# Altium project Quick start  Help for beginners.PrjPcb
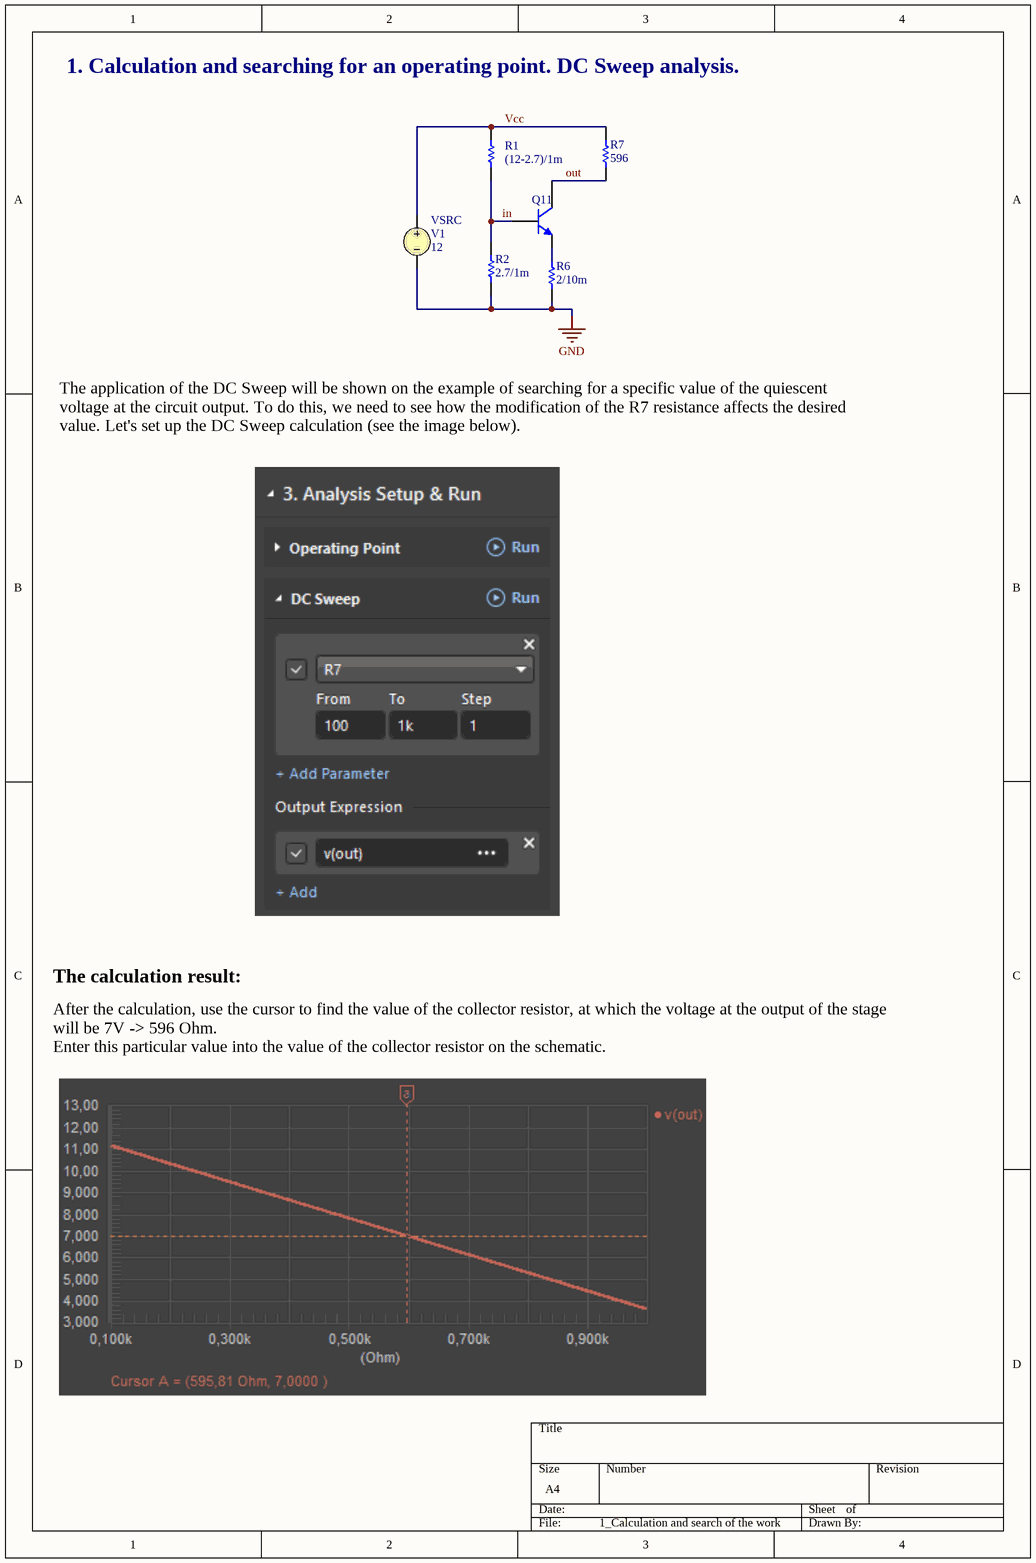
[diagram p0: 1_Calculation and search of the working point.SchDoc]
7 sheets, 56 parts. Net scope: global (net labels, ports and power ports of the same name join across sheets).
Sheets:
  1_Calculation and search of the working point.SchDoc
  2_Thermal stability.SchDoc
  3_Reinforcing properties  Frequency characteristics.SchDoc
  4_A real transistor.SchDoc
  5_Changing the gain.SchDoc
  6_Oscillator.SchDoc
  7_Sensitivity.SchDoc

## Sheet 1_Calculation and search of the working point.SchDoc
size A4 portrait; SheetNumber: 1; SheetTotal: 1; SPICEModelCacheCSPBSJPQ: <root> / <DocumentId>CSPBSJPQ</DocumentId> / </root>

### Parts
Q11  Bipolar  NPN 3 Pins  Transistor  Modified Version of the Gummel-Poon Model  (value not drawn)
R1  value (12-2.7)/1m  (hidden comment: Resistor)
R2  value 2.7/1m  (hidden comment: Resistor)
R6  value 2/10m  (hidden comment: Resistor)
R7  value 596  (hidden comment: Resistor)
V1  VSRC  value 12

### Nets
GND: R2.2 R6.1 V1.2
in: Q11.2(B) R1.1 R2.1
out: Q11.1(C) R7.1
Vcc: R1.2 R7.2 V1.1
NetQ11_3: Q11.3(E) R6.2

### Notes on the sheet
- 1. Calculation and searching for an operating point. DC Sweep analysis.
- The application of the DC Sweep will be shown on the example of searching for a specific value of the quiescent voltage at the circuit output. To do this, we need to see how the modification of the R7 resistance affects the desired value. Let's set up the DC Sweep calculation (see the image below).
- The calculation result:
- After the calculation, use the cursor to find the value of the collector resistor, at which the voltage at the output of the stage will be 7V -> 596 Ohm.
  Enter this particular value into the value of the collector resistor on the schematic.

### Library data of the parts
Q11 = BJT NPN_MGP: BF: 100; AF: 0; BR: 1; EG: 1.11; FC: 0.5; IS: 1e-16; MJC: 0.33; NC: 2; NE: 1.5; TNOM: 27; VBC_MAX: 1e99; VJC: 0.75; XTI: 3; SimulationGenericComponent: True; CJC: 0; CJE: 0; CJS: 0; CTC: 0; CTE: 0; CTS: 0; IKF: 0; IKR: 0; IRB: 0; ISC: 0; ISE: 0; ISS: 0; ITF: 0; KF: 0; MJE: 0.33; MJS: 0; NF: 1; NKF: 0.5; NR: 1; NS: 1; PTF: 0; RB: 0; RBM: 0; RC: 0; RE: 0; SUBS: 1; TBF1: 0; TBF2: 0; TBR1: 0; TBR2: 0; TF: 0; TIKF1: 0; TIKF2: 0; TIKR1: 0; TIKR2: 0; TIRB1: 0; TIRB2: 0; TIS1: 0; TIS2: 0; TISC1: 0; TISC2: 0; TISE1: 0; TISE2: 0; TITF1: 0; TITF2: 0; TLEV: 0; TLEVC: 0; TMJC1: 0; TMJC2: 0; TMJE1: 0; TMJE2: 0; TMJS1: 0; TMJS2: 0; TNC1: 0; TNC2: 0; TNE1: 0; TNE2: 0; TNF1: 0; TNF2: 0; TNR1: 0; TNR2: 0; TNS1: 0; TNS2: 0; TR: 0; TRB1: 0; TRB2: 0; TRC1: 0; TRC2: 0; TRE1: 0; TRE2: 0; TRM1: 0; TRM2: 0; TTF1: 0; TTF2: 0; TTR1: 0; TTR2: 0; TVAF1: 0; TVAF2: 0; TVAR1: 0; TVAR2: 0; TVJC: 0; TVJE: 0; TVJS: 0; VAF: 0; VAR: 0; VBE_MAX: 1e99; VCE_MAX: 1e99; VJE: 0.75; VJS: 0.75; VTF: 0; XCJC: 1; XTB: 0; XTF: 0
V1 = VSRC: Voltage Source; Note: PCB Footprint - Not required; AC Magnitude: 0; Published: 30-July-2020; LatestRevisionDate: 30-July-2020; LatestRevisionNote: Re-released for DXP Platform.; PackageReference: Not Applicable; Publisher: Altium Limited

## Sheet 2_Thermal stability.SchDoc
size A4; SheetNumber: 1; SheetTotal: 1; SPICEModelCacheCSPBSJPQ: <root> / <DocumentId>CSPBSJPQ</DocumentId> / </root>
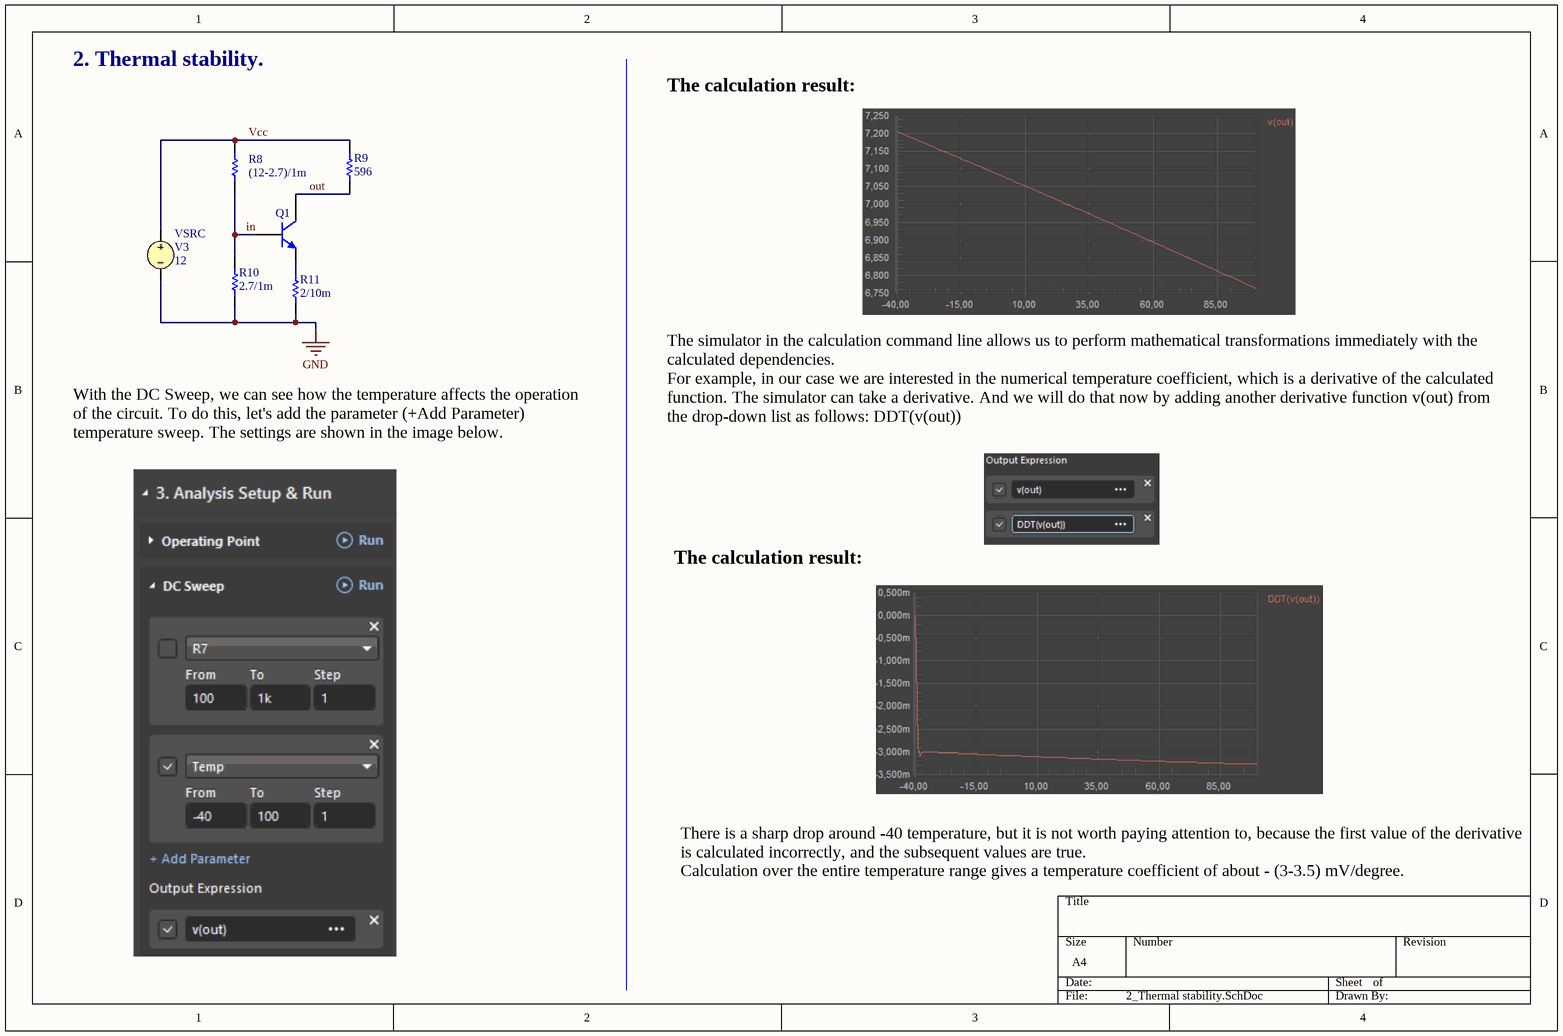
[diagram p1: 2_Thermal stability.SchDoc]

### Parts
Q1  Bipolar  NPN 3 Pins  Transistor  Modified Version of the Gummel-Poon Model  (value not drawn)
R8  value (12-2.7)/1m  (hidden comment: Resistor)
R9  value 596  (hidden comment: Resistor)
R10  value 2.7/1m  (hidden comment: Resistor)
R11  value 2/10m  (hidden comment: Resistor)
V3  VSRC  value 12

### Nets
GND: R10.2 R11.1 V3.2
in: Q1.2(B) R8.1 R10.1
out: Q1.1(C) R9.1
Vcc: R8.2 R9.2 V3.1
NetQ1_3: Q1.3(E) R11.2

### Notes on the sheet
- 2. Thermal stability.
- The calculation result:
- The simulator in the calculation command line allows us to perform mathematical transformations immediately with the calculated dependencies.
  For example, in our case we are interested in the numerical temperature coefficient, which is a derivative of the calculated function. The simulator can take a derivative. And we will do that now by adding another derivative function v(out) from the drop-down list as follows: DDT(v(out))
- With the DC Sweep, we can see how the temperature affects the operation of the circuit. To do this, let's add the parameter (+Add Parameter) temperature sweep. The settings are shown in the image below.
- There is a sharp drop around -40 temperature, but it is not worth paying attention to, because the first value of the derivative is calculated incorrectly, and the subsequent values are true.
  Calculation over the entire temperature range gives a temperature coefficient of about - (3-3.5) mV/degree.

### Library data of the parts
Q1 = BJT NPN_MGP: as Q11 on sheet 1_Calculation and search of the working point; CJC: 0; CJE: 0; CJS: 0; CTC: 0; CTE: 0; CTS: 0; IKF: 0; IKR: 0; IRB: 0; ISC: 0; ISE: 0; ISS: 0; ITF: 0; KF: 0; MJE: 0.33; MJS: 0; NF: 1; NKF: 0.5; NR: 1; NS: 1; PTF: 0; RB: 0; RBM: 0; RC: 0; RE: 0; SUBS: 1; TBF1: 0; TBF2: 0; TBR1: 0; TBR2: 0; TF: 0; TIKF1: 0; TIKF2: 0; TIKR1: 0; TIKR2: 0; TIRB1: 0; TIRB2: 0; TIS1: 0; TIS2: 0; TISC1: 0; TISC2: 0; TISE1: 0; TISE2: 0; TITF1: 0; TITF2: 0; TLEV: 0; TLEVC: 0; TMJC1: 0; TMJC2: 0; TMJE1: 0; TMJE2: 0; TMJS1: 0; TMJS2: 0; TNC1: 0; TNC2: 0; TNE1: 0; TNE2: 0; TNF1: 0; TNF2: 0; TNR1: 0; TNR2: 0; TNS1: 0; TNS2: 0; TR: 0; TRB1: 0; TRB2: 0; TRC1: 0; TRC2: 0; TRE1: 0; TRE2: 0; TRM1: 0; TRM2: 0; TTF1: 0; TTF2: 0; TTR1: 0; TTR2: 0; TVAF1: 0; TVAF2: 0; TVAR1: 0; TVAR2: 0; TVJC: 0; TVJE: 0; TVJS: 0; VAF: 0; VAR: 0; VBE_MAX: 1e99; VCE_MAX: 1e99; VJE: 0.75; VJS: 0.75; VTF: 0; XCJC: 1; XTB: 0; XTF: 0
V3 = VSRC: as V1 on sheet 1_Calculation and search of the working point; Published: 30-July-2020; LatestRevisionDate: 30-July-2020; LatestRevisionNote: Re-released for DXP Platform.; PackageReference: Not Applicable; Publisher: Altium Limited

## Sheet 3_Reinforcing properties  Frequency characteristics.SchDoc
size A4; SheetNumber: 1; SheetTotal: 1; SPICEModelCacheCSPBSJPQ: <root> / <DocumentId>CSPBSJPQ</DocumentId> / </root>
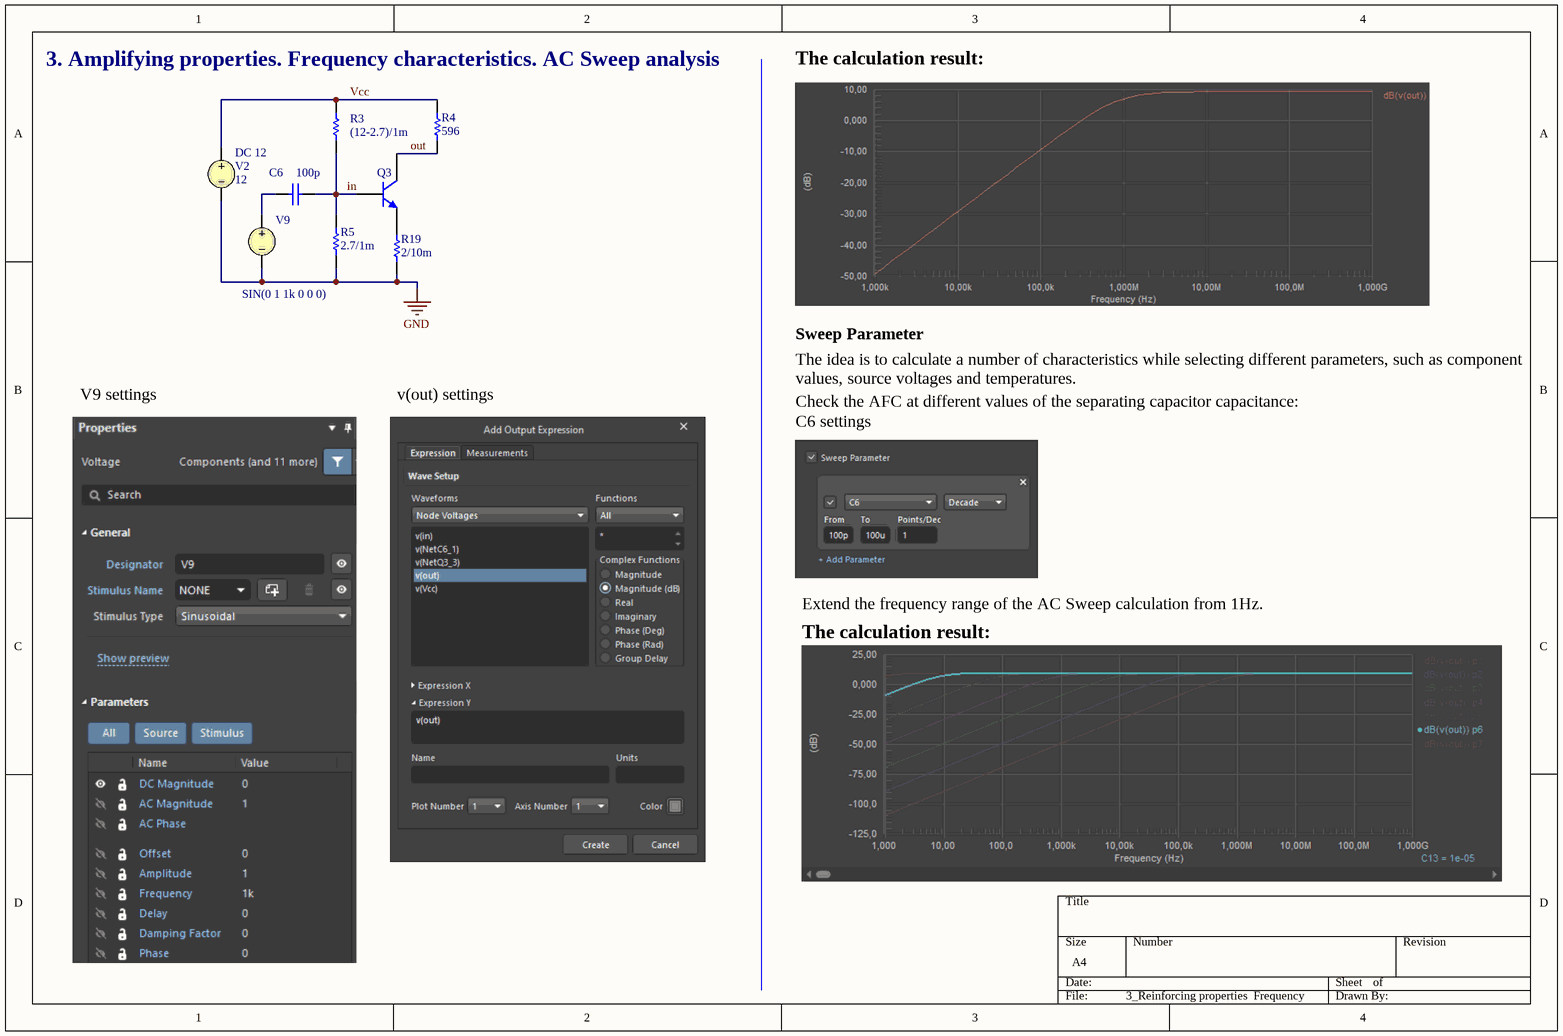
[diagram p2: 3_Reinforcing properties  Frequency characteristics.SchDoc]

### Parts
C6  value 100p  (hidden comment: Capacitor)
Q3  Bipolar  NPN 3 Pins  Transistor  Modified Version of the Gummel-Poon Model  (value not drawn)
R3  value (12-2.7)/1m  (hidden comment: Resistor)
R4  value 596  (hidden comment: Resistor)
R5  value 2.7/1m  (hidden comment: Resistor)
R19  value 2/10m  (hidden comment: Resistor)
V2  DC 12  value 12
V9  SIN(0 1 1k 0 0 0)

### Nets
GND: R5.2 R19.1 V2.2 V9.2
in: C6.2 Q3.2(B) R3.1 R5.1
out: Q3.1(C) R4.1
Vcc: R3.2 R4.2 V2.1
NetC6_1: C6.1 V9.1
NetQ3_3: Q3.3(E) R19.2

### Notes on the sheet
- 3. Amplifying properties. Frequency characteristics. AC Sweep analysis
- The calculation result:
- The idea is to calculate a number of characteristics while selecting different parameters, such as component values, source voltages and temperatures.
- Sweep Parameter
- V9 settings
- v(out) settings
- Check the AFC at different values of the separating capacitor capacitance:
- C6 settings
- Extend the frequency range of the AC Sweep calculation from 1Hz.

### Library data of the parts
C6 = Capacitor: SimulationGenericComponent: True
Q3 = BJT NPN_MGP: as Q11 on sheet 1_Calculation and search of the working point; CJC: 0; CJE: 0; CJS: 0; CTC: 0; CTE: 0; CTS: 0; IKF: 0; IKR: 0; IRB: 0; ISC: 0; ISE: 0; ISS: 0; ITF: 0; KF: 0; MJE: 0.33; MJS: 0; NF: 1; NKF: 0.5; NR: 1; NS: 1; PTF: 0; RB: 0; RBM: 0; RC: 0; RE: 0; SUBS: 1; TBF1: 0; TBF2: 0; TBR1: 0; TBR2: 0; TF: 0; TIKF1: 0; TIKF2: 0; TIKR1: 0; TIKR2: 0; TIRB1: 0; TIRB2: 0; TIS1: 0; TIS2: 0; TISC1: 0; TISC2: 0; TISE1: 0; TISE2: 0; TITF1: 0; TITF2: 0; TLEV: 0; TLEVC: 0; TMJC1: 0; TMJC2: 0; TMJE1: 0; TMJE2: 0; TMJS1: 0; TMJS2: 0; TNC1: 0; TNC2: 0; TNE1: 0; TNE2: 0; TNF1: 0; TNF2: 0; TNR1: 0; TNR2: 0; TNS1: 0; TNS2: 0; TR: 0; TRB1: 0; TRB2: 0; TRC1: 0; TRC2: 0; TRE1: 0; TRE2: 0; TRM1: 0; TRM2: 0; TTF1: 0; TTF2: 0; TTR1: 0; TTR2: 0; TVAF1: 0; TVAF2: 0; TVAR1: 0; TVAR2: 0; TVJC: 0; TVJE: 0; TVJS: 0; VAF: 0; VAR: 0; VBE_MAX: 1e99; VCE_MAX: 1e99; VJE: 0.75; VJS: 0.75; VTF: 0; XCJC: 1; XTB: 0; XTF: 0
V2 = VSRC: as V1 on sheet 1_Calculation and search of the working point; Published: 30-July-2020; LatestRevisionDate: 30-July-2020; LatestRevisionNote: Re-released for DXP Platform.; PackageReference: Not Applicable; Publisher: Altium Limited
V9 = VSRC: Voltage Source; Note: PCB Footprint - Not required; DC Magnitude: 0; AC Magnitude: 1; Published: 30-July-2020; LatestRevisionDate: 30-July-2020; LatestRevisionNote: Re-released for DXP Platform.; PackageReference: Not Applicable; Publisher: Altium Limited; Offset: 0; Amplitude: 1; Frequency: 1k; Delay: 0; Damping Factor: 0; Phase: 0

## Sheet 4_A real transistor.SchDoc
size A4; SheetNumber: 1; SheetTotal: 1; SPICEModelCacheCSPBSJPQ: <root> / <DocumentId>CSPBSJPQ</DocumentId> / <CacheFrame Number="0"> / <Model Name="bc846" Kind="MDL"> / <Text>.MODEL BC846 NPN(  BF=324.4 BR=8.29 CJC=3.347E-12 CJE=1.244E-11 FC=0.979 IKF=0.109 IKR=0.09 IRB=5E-06 IS=1.822E-14 ISC=9.982E-12 ISE=2.894E-16 ITF=0.3131 MJC=0.391 MJE=0.3656 MJS=0.333 NC=1.763 NE=1.4 NF=0.9932 NK=500M NR=0.9931 RB=10 RBM=5 RC=0.7014 RE=0.649 TF=4.908E-10 TR=9E-08 VAF=82 VAR=17.9 VJC=0.5463 VJE=0.7579 VTF=2.927 XCJC=0.6193 XTF=9.51 )</Text> / </Model> / </CacheFrame> / </root>
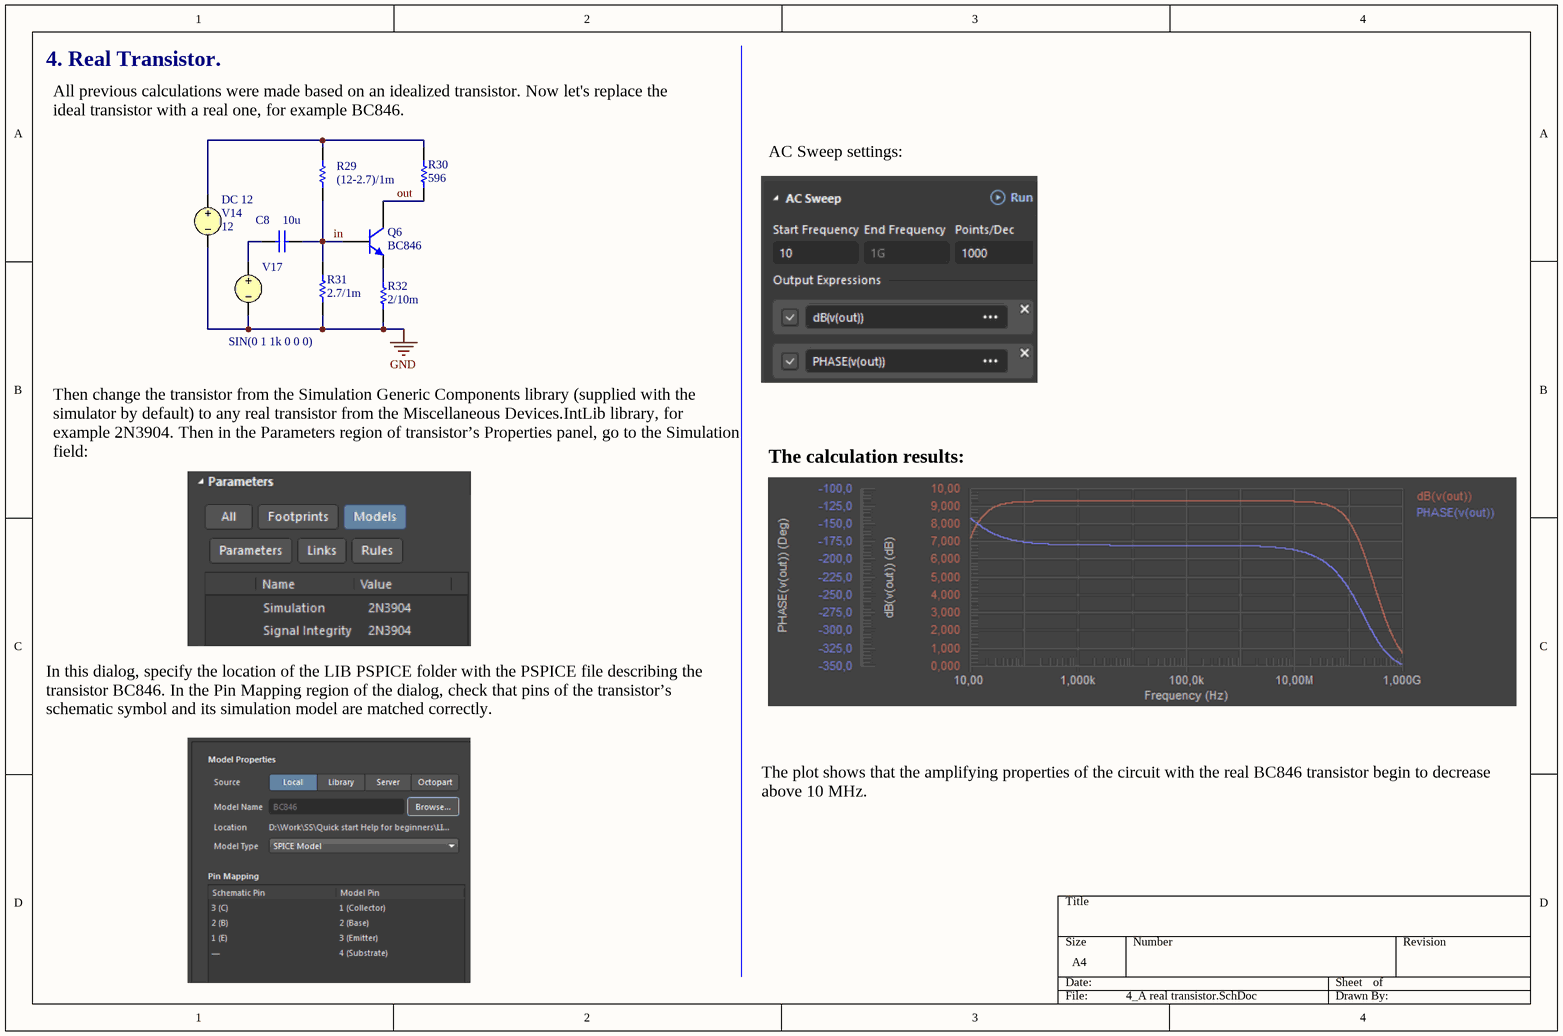
[diagram p3: 4_A real transistor.SchDoc]

### Parts
C8  value 10u  (hidden comment: Capacitor)
Q6  BC846  [TO-92A]
R29  value (12-2.7)/1m  (hidden comment: Resistor)
R30  value 596  (hidden comment: Resistor)
R31  value 2.7/1m  (hidden comment: Resistor)
R32  value 2/10m  (hidden comment: Resistor)
V14  DC 12  value 12
V17  SIN(0 1 1k 0 0 0)

### Nets
GND: R31.2 R32.1 V14.2 V17.2
in: C8.2 Q6.2(B) R29.1 R31.1
out: Q6.3(C) R30.1
Vcc: R29.2 R30.2 V14.1
NetC8_1: C8.1 V17.1
NetQ6_1: Q6.1(E) R32.2

### Notes on the sheet
- 4. Real Transistor.
- All previous calculations were made based on an idealized transistor. Now let's replace the ideal transistor with a real one, for example BC846.
- AC Sweep settings:
- Then change the transistor from the Simulation Generic Components library (supplied with the simulator by default) to any real transistor from the Miscellaneous Devices.IntLib library, for example 2N3904. Then in the Parameters region of transistor’s Properties panel, go to the Simulation field:
- The calculation results:
- In this dialog, specify the location of the LIB PSPICE folder with the PSPICE file describing the transistor BC846. In the Pin Mapping region of the dialog, check that pins of the transistor’s schematic symbol and its simulation model are matched correctly.
- The plot shows that the amplifying properties of the circuit with the real BC846 transistor begin to decrease above 10 MHz.

### Library data of the parts
C8 = Capacitor: SimulationGenericComponent: True
Q6 = 2N3904: NPN General Purpose Amplifier; Published: 8-Jun-2000; LatestRevisionDate: 15-Jan-2003; LatestRevisionNote: PCB Footprint 'BCY-W3/D4.7' replaced; DatasheetVersion: 1997; PackageVersion: Sep-1998; PackageReference: TO-92A; Publisher: Altium Limited; PackageDescription: TO, Flat Index; 3 In-Line, Axial Leads; Body Dia. 4.5mm; Leads 0.51 x 0.48 mm (max); ComponentLink1Description: Manufacturer Link; ComponentLink1URL: http://www.fairchildsemi.com/; ComponentLink2Description: Datasheet; ComponentLink2URL: http://www.fairchildsemi.com/ds/2N%2F2N3904.pdf
V14 = VSRC: as V1 on sheet 1_Calculation and search of the working point; Published: 30-July-2020; LatestRevisionDate: 30-July-2020; LatestRevisionNote: Re-released for DXP Platform.; PackageReference: Not Applicable; Publisher: Altium Limited
V17 = VSRC: as V9 on sheet 3_Reinforcing properties  Frequency characteristics; Published: 30-July-2020; LatestRevisionDate: 30-July-2020; LatestRevisionNote: Re-released for DXP Platform.; PackageReference: Not Applicable; Publisher: Altium Limited; Offset: 0; Amplitude: 1; Frequency: 1k; Delay: 0; Damping Factor: 0; Phase: 0

## Sheet 5_Changing the gain.SchDoc
size A4; SheetNumber: 1; SheetTotal: 1; SPICEModelCacheCSPBSJPQ: <root> / <DocumentId>CSPBSJPQ</DocumentId> / <CacheFrame Number="0"> / <Model Name="bc846" Kind="MDL"> / <Text>.MODEL BC846 NPN(  BF=324.4 BR=8.29 CJC=3.347E-12 CJE=1.244E-11 FC=0.979 IKF=0.109 IKR=0.09 IRB=5E-06 IS=1.822E-14 ISC=9.982E-12 ISE=2.894E-16 ITF=0.3131 MJC=0.391 MJE=0.3656 MJS=0.333 NC=1.763 NE=1.4 NF=0.9932 NK=500M NR=0.9931 RB=10 RBM=5 RC=0.7014 RE=0.649 TF=4.908E-10 TR=9E-08 VAF=82 VAR=17.9 VJC=0.5463 VJE=0.7579 VTF=2.927 XCJC=0.6193 XTF=9.51 )</Text> / </Model> / </CacheFrame> / </root>
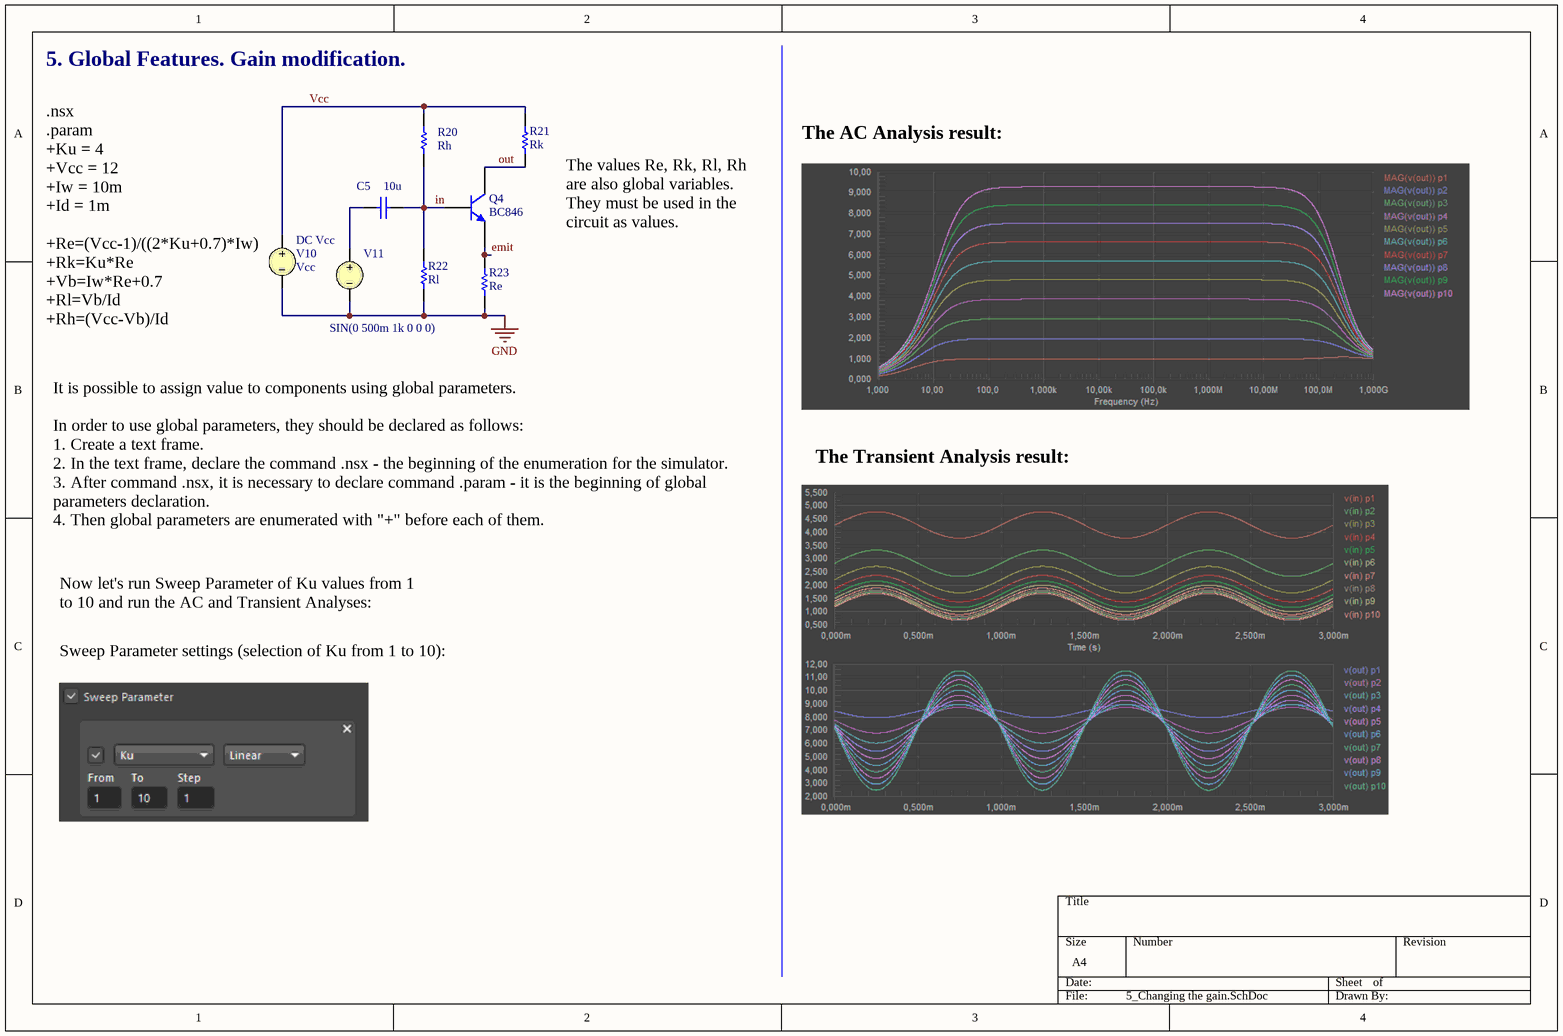
[diagram p4: 5_Changing the gain.SchDoc]

### Parts
C5  value 10u  (hidden comment: Capacitor)
Q4  BC846  [TO-92A]
R20  value Rh  (hidden comment: Resistor)
R21  value Rk  (hidden comment: Resistor)
R22  value Rl  (hidden comment: Resistor)
R23  value Re  (hidden comment: Resistor)
V10  DC Vcc  value Vcc
V11  SIN(0 500m 1k 0 0 0)

### Nets
GND: R22.2 R23.1 V10.2 V11.2
emit: Q4.1(E) R23.2
in: C5.2 Q4.2(B) R20.1 R22.1
out: Q4.3(C) R21.1
Vcc: R20.2 R21.2 V10.1
NetC5_1: C5.1 V11.1

### Notes on the sheet
- 5. Global Features. Gain modification.
- The AC Analysis result:
- (near R21) The values Re, Rk, Rl, Rh are also global variables. They must be used in the circuit as values.
- (near V10) .nsx
  .param
  +Ku = 4
  +Vcc = 12
  +Iw = 10m
  +Id = 1m
  +Re=(Vcc-1)/((2*Ku+0.7)*Iw)
  +Rk=Ku*Re
  +Vb=Iw*Re+0.7
  +Rl=Vb/Id
  +Rh=(Vcc-Vb)/Id
- The Transient Analysis result:
- It is possible to assign value to components using global parameters.
  In order to use global parameters, they should be declared as follows:
  1. Create a text frame.
  2. In the text frame, declare the command .nsx - the beginning of the enumeration for the simulator.
  3. After command .nsx, it is necessary to declare command .param - it is the beginning of global parameters declaration.
  4. Then global parameters are enumerated with "+" before each of them.
- Now let's run Sweep Parameter of Ku values from 1 to 10 and run the AC and Transient Analyses:
- Sweep Parameter settings (selection of Ku from 1 to 10):

### Library data of the parts
C5 = Capacitor: SimulationGenericComponent: True
Q4 = 2N3904: NPN General Purpose Amplifier; Published: 8-Jun-2000; LatestRevisionDate: 15-Jan-2003; LatestRevisionNote: PCB Footprint 'BCY-W3/D4.7' replaced; DatasheetVersion: 1997; PackageVersion: Sep-1998; PackageReference: TO-92A; Publisher: Altium Limited; PackageDescription: TO, Flat Index; 3 In-Line, Axial Leads; Body Dia. 4.5mm; Leads 0.51 x 0.48 mm (max); ComponentLink1Description: Manufacturer Link; ComponentLink1URL: http://www.fairchildsemi.com/; ComponentLink2Description: Datasheet; ComponentLink2URL: http://www.fairchildsemi.com/ds/2N%2F2N3904.pdf
V10 = VSRC: as V1 on sheet 1_Calculation and search of the working point; Published: 30-July-2020; LatestRevisionDate: 30-July-2020; LatestRevisionNote: Re-released for DXP Platform.; PackageReference: Not Applicable; Publisher: Altium Limited
V11 = VSRC: as V9 on sheet 3_Reinforcing properties  Frequency characteristics; Published: 30-July-2020; LatestRevisionDate: 30-July-2020; LatestRevisionNote: Re-released for DXP Platform.; PackageReference: Not Applicable; Publisher: Altium Limited; Offset: 0; Amplitude: 500m; Frequency: 1k; Delay: 0; Damping Factor: 0; Phase: 0

## Sheet 6_Oscillator.SchDoc
size A4; SheetNumber: 1; SheetTotal: 1; SPICEModelCacheCSPBSJPQ: <root> / <DocumentId>CSPBSJPQ</DocumentId> / <CacheFrame Number="0"> / <Model Name="bc846" Kind="MDL"> / <Text>.MODEL BC846 NPN(  BF=324.4 BR=8.29 CJC=3.347E-12 CJE=1.244E-11 FC=0.979 IKF=0.109 IKR=0.09 IRB=5E-06 IS=1.822E-14 ISC=9.982E-12 ISE=2.894E-16 ITF=0.3131 MJC=0.391 MJE=0.3656 MJS=0.333 NC=1.763 NE=1.4 NF=0.9932 NK=500M NR=0.9931 RB=10 RBM=5 RC=0.7014 RE=0.649 TF=4.908E-10 TR=9E-08 VAF=82 VAR=17.9 VJC=0.5463 VJE=0.7579 VTF=2.927 XCJC=0.6193 XTF=9.51 )</Text> / </Model> / </CacheFrame> / </root>
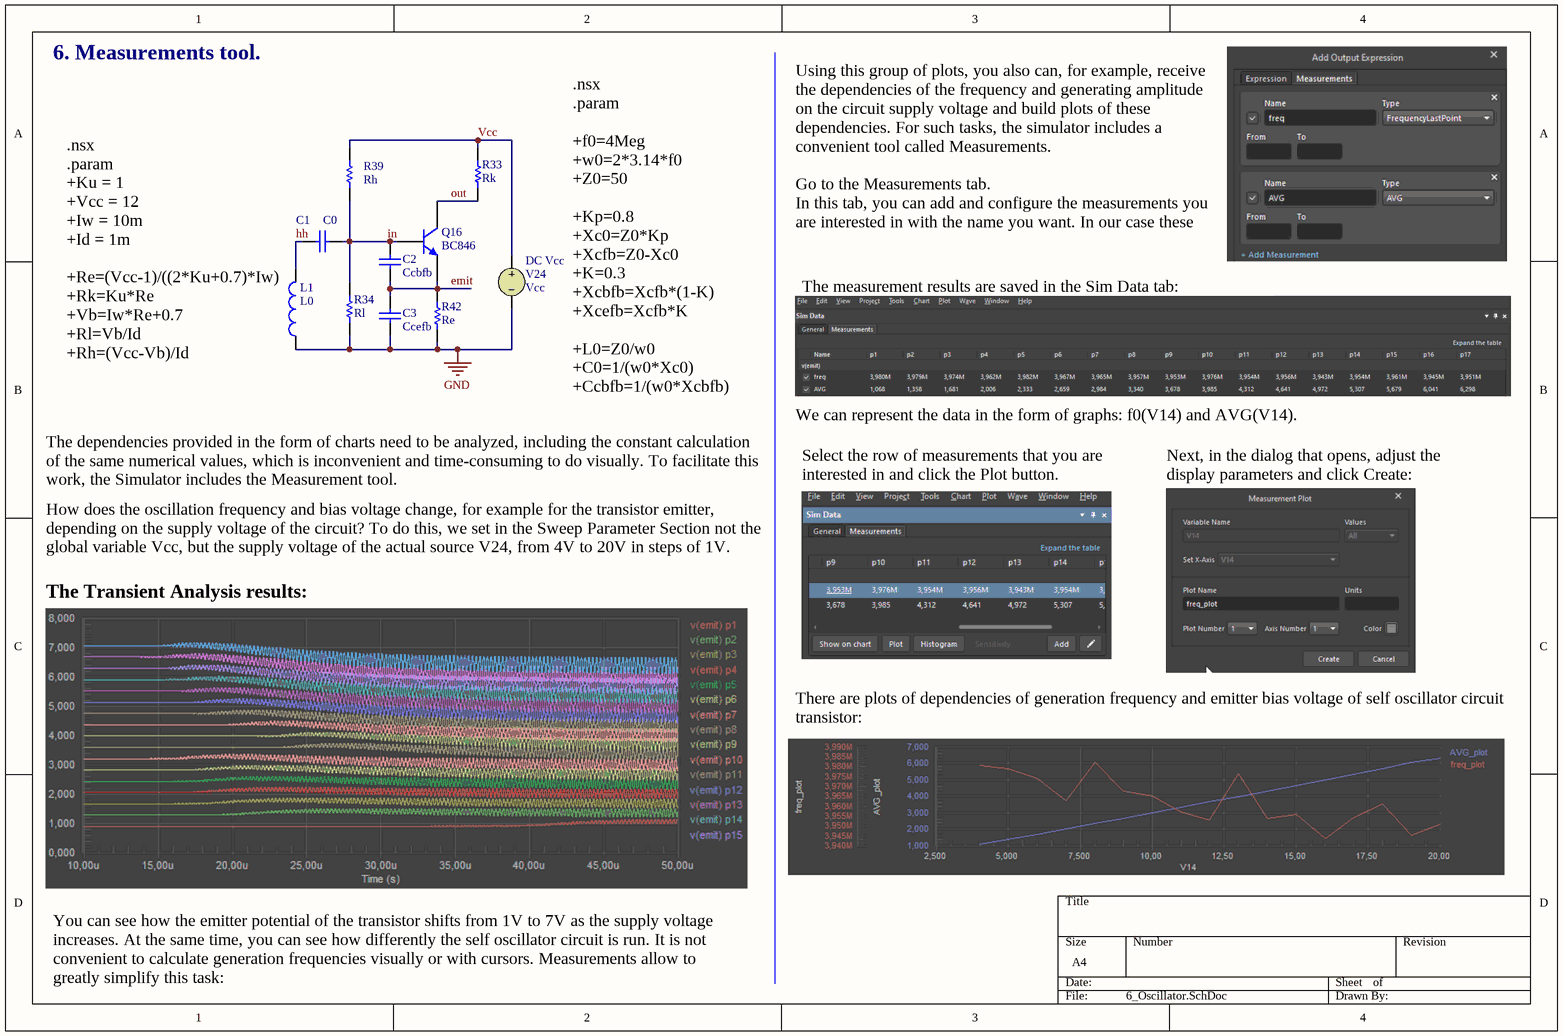
[diagram p5: 6_Oscillator.SchDoc]

### Parts
C1  value C0  (hidden comment: Capacitor)
C2  value Ccbfb  (hidden comment: Capacitor)
C3  value Ccefb  (hidden comment: Capacitor)
L1  value L0  (hidden comment: Inductor)
Q16  BC846  [TO-92A]
R33  value Rk  (hidden comment: Resistor)
R34  value Rl  (hidden comment: Resistor)
R39  value Rh  (hidden comment: Resistor)
R42  value Re  (hidden comment: Resistor)
V24  DC Vcc  value Vcc

### Nets
GND: C3.1 L1.1 R34.2 R42.1 V24.2
emit: C2.1 C3.2 Q16.1(E) R42.2
hh: C1.1 L1.2
in: C1.2 C2.2 Q16.2(B) R34.1 R39.1
out: Q16.3(C) R33.1
Vcc: R33.2 R39.2 V24.1

### Notes on the sheet
- 6. Measurements tool.
- Using this group of plots, you also can, for example, receive the dependencies of the frequency and generating amplitude on the circuit supply voltage and build plots of these dependencies. For such tasks, the simulator includes a convenient tool called Measurements.
  Go to the Measurements tab.
  In this tab, you can add and configure the measurements you are interested in with the name you want. In our case these are: FrequenciLastPoint and AVG:
- The measurement results are saved in the Sim Data tab:
- (near L1) .nsx
  .param
  +Ku = 1
  +Vcc = 12
  +Iw = 10m
  +Id = 1m
  +Re=(Vcc-1)/((2*Ku+0.7)*Iw)
  +Rk=Ku*Re
  +Vb=Iw*Re+0.7
  +Rl=Vb/Id
  +Rh=(Vcc-Vb)/Id
- .nsx
  .param
  +f0=4Meg
  +w0=2*3.14*f0
  +Z0=50
  +Kp=0.8
  +Xc0=Z0*Kp
  +Xcfb=Z0-Xc0
  +K=0.3
  +Xcbfb=Xcfb*(1-K)
  +Xcefb=Xcfb*K
  +L0=Z0/w0
  +C0=1/(w0*Xc0)
  +Ccbfb=1/(w0*Xcbfb)
  +Ccefb=1/(w0*Xcefb)
- We can represent the data in the form of graphs: f0(V14) and AVG(V14).
- The dependencies provided in the form of charts need to be analyzed, including the constant calculation of the same numerical values, which is inconvenient and time-consuming to do visually. To facilitate this work, the Simulator includes the Measurement tool.
- Select the row of measurements that you are interested in and click the Plot button.
- Next, in the dialog that opens, adjust the display parameters and click Create:
- How does the oscillation frequency and bias voltage change, for example for the transistor emitter, depending on the supply voltage of the circuit? To do this, we set in the Sweep Parameter Section not the global variable Vcc, but the supply voltage of the actual source V24, from 4V to 20V in steps of 1V.
- The Transient Analysis results:
- There are plots of dependencies of generation frequency and emitter bias voltage of self oscillator circuit transistor:
- You can see how the emitter potential of the transistor shifts from 1V to 7V as the supply voltage increases. At the same time, you can see how differently the self oscillator circuit is run. It is not convenient to calculate generation frequencies visually or with cursors. Measurements allow to greatly simplify this task:

### Library data of the parts
C1-C3 = Capacitor: SimulationGenericComponent: True
L1 = Inductor: SimulationGenericComponent: True
Q16 = 2N3904: NPN General Purpose Amplifier; Published: 8-Jun-2000; LatestRevisionDate: 15-Jan-2003; LatestRevisionNote: PCB Footprint 'BCY-W3/D4.7' replaced; DatasheetVersion: 1997; PackageVersion: Sep-1998; PackageReference: TO-92A; Publisher: Altium Limited; PackageDescription: TO, Flat Index; 3 In-Line, Axial Leads; Body Dia. 4.5mm; Leads 0.51 x 0.48 mm (max); ComponentLink1Description: Manufacturer Link; ComponentLink1URL: http://www.fairchildsemi.com/; ComponentLink2Description: Datasheet; ComponentLink2URL: http://www.fairchildsemi.com/ds/2N%2F2N3904.pdf
V24 = VSRC: as V1 on sheet 1_Calculation and search of the working point; Published: 30-July-2020; LatestRevisionDate: 30-July-2020; LatestRevisionNote: Re-released for DXP Platform.; PackageReference: Not Applicable; Publisher: Altium Limited

## Sheet 7_Sensitivity.SchDoc
size A4; SheetNumber: 1; SheetTotal: 1; SPICEModelCacheCSPBSJPQ: <root> / <DocumentId>CSPBSJPQ</DocumentId> / <CacheFrame Number="0"> / <Model Name="bc846" Kind="MDL"> / <Text>.MODEL BC846 NPN(  BF=324.4 BR=8.29 CJC=3.347E-12 CJE=1.244E-11 FC=0.979 IKF=0.109 IKR=0.09 IRB=5E-06 IS=1.822E-14 ISC=9.982E-12 ISE=2.894E-16 ITF=0.3131 MJC=0.391 MJE=0.3656 MJS=0.333 NC=1.763 NE=1.4 NF=0.9932 NK=500M NR=0.9931 RB=10 RBM=5 RC=0.7014 RE=0.649 TF=4.908E-10 TR=9E-08 VAF=82 VAR=17.9 VJC=0.5463 VJE=0.7579 VTF=2.927 XCJC=0.6193 XTF=9.51 )</Text> / </Model> / </CacheFrame> / </root>
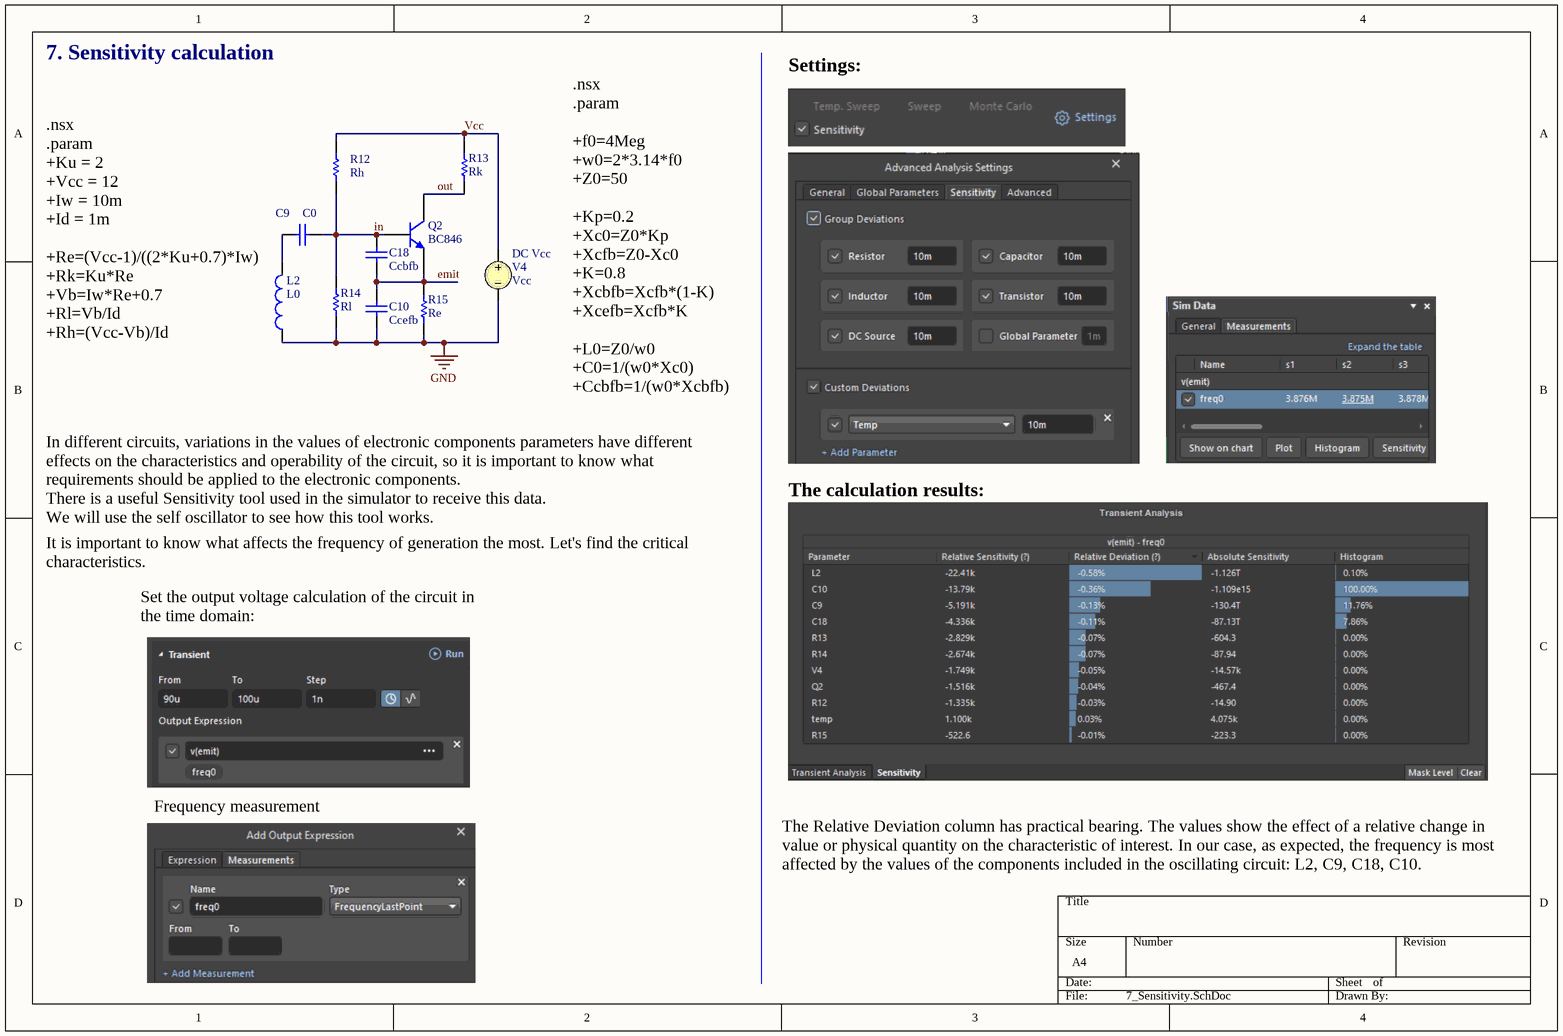
[diagram p6: 7_Sensitivity.SchDoc]

### Parts
C9  value C0  (hidden comment: Capacitor)
C10  value Ccefb  (hidden comment: Capacitor)
C18  value Ccbfb  (hidden comment: Capacitor)
L2  value L0  (hidden comment: Inductor)
Q2  BC846  [TO-92A]
R12  value Rh  (hidden comment: Resistor)
R13  value Rk  (hidden comment: Resistor)
R14  value Rl  (hidden comment: Resistor)
R15  value Re  (hidden comment: Resistor)
V4  DC Vcc  value Vcc

### Nets
GND: C10.1 L2.1 R14.2 R15.1 V4.2
emit: C10.2 C18.1 Q2.1(E) R15.2
in: C9.2 C18.2 Q2.2(B) R12.1 R14.1
out: Q2.3(C) R13.1
Vcc: R12.2 R13.2 V4.1
NetC9_1: C9.1 L2.2

### Notes on the sheet
- 7. Sensitivity calculation
- Settings:
- (near L2) .nsx
  .param
  +Ku = 2
  +Vcc = 12
  +Iw = 10m
  +Id = 1m
  +Re=(Vcc-1)/((2*Ku+0.7)*Iw)
  +Rk=Ku*Re
  +Vb=Iw*Re+0.7
  +Rl=Vb/Id
  +Rh=(Vcc-Vb)/Id
- .nsx
  .param
  +f0=4Meg
  +w0=2*3.14*f0
  +Z0=50
  +Kp=0.2
  +Xc0=Z0*Kp
  +Xcfb=Z0-Xc0
  +K=0.8
  +Xcbfb=Xcfb*(1-K)
  +Xcefb=Xcfb*K
  +L0=Z0/w0
  +C0=1/(w0*Xc0)
  +Ccbfb=1/(w0*Xcbfb)
  +Ccefb=1/(w0*Xcefb)
- In different circuits, variations in the values of electronic components parameters have different effects on the characteristics and operability of the circuit, so it is important to know what requirements should be applied to the electronic components.
  There is a useful Sensitivity tool used in the simulator to receive this data.
  We will use the self oscillator to see how this tool works.
- The calculation results:
- It is important to know what affects the frequency of generation the most. Let's find the critical characteristics.
- Set the output voltage calculation of the circuit in the time domain:
- Frequency measurement
- The Relative Deviation column has practical bearing. The values show the effect of a relative change in value or physical quantity on the characteristic of interest. In our case, as expected, the frequency is most affected by the values of the components included in the oscillating circuit: L2, C9, C18, C10.

### Library data of the parts
C9 C10 C18 = Capacitor: SimulationGenericComponent: True
L2 = Inductor: SimulationGenericComponent: True
Q2 = 2N3904: NPN General Purpose Amplifier; Published: 8-Jun-2000; LatestRevisionDate: 15-Jan-2003; LatestRevisionNote: PCB Footprint 'BCY-W3/D4.7' replaced; DatasheetVersion: 1997; PackageVersion: Sep-1998; PackageReference: TO-92A; Publisher: Altium Limited; PackageDescription: TO, Flat Index; 3 In-Line, Axial Leads; Body Dia. 4.5mm; Leads 0.51 x 0.48 mm (max); ComponentLink1Description: Manufacturer Link; ComponentLink1URL: http://www.fairchildsemi.com/; ComponentLink2Description: Datasheet; ComponentLink2URL: http://www.fairchildsemi.com/ds/2N%2F2N3904.pdf
V4 = VSRC: as V1 on sheet 1_Calculation and search of the working point; Published: 30-July-2020; LatestRevisionDate: 30-July-2020; LatestRevisionNote: Re-released for DXP Platform.; PackageReference: Not Applicable; Publisher: Altium Limited

## Nets that join several sheets
GND: 1_Calculation and search of the working point (R2.2 R6.1 V1.2), 2_Thermal stability (R10.2 R11.1 V3.2), 3_Reinforcing properties  Frequency characteristics (R5.2 R19.1 V2.2 V9.2), 4_A real transistor (R31.2 R32.1 V14.2 V17.2), 5_Changing the gain (R22.2 R23.1 V10.2 V11.2), 6_Oscillator (5 pins), 7_Sensitivity (5 pins)
emit: 5_Changing the gain (Q4.1 R23.2), 6_Oscillator (C2.1 C3.2 Q16.1 R42.2), 7_Sensitivity (C10.2 C18.1 Q2.1 R15.2)
in: 1_Calculation and search of the working point (Q11.2 R1.1 R2.1), 2_Thermal stability (Q1.2 R8.1 R10.1), 3_Reinforcing properties  Frequency characteristics (C6.2 Q3.2 R3.1 R5.1), 4_A real transistor (C8.2 Q6.2 R29.1 R31.1), 5_Changing the gain (C5.2 Q4.2 R20.1 R22.1), 6_Oscillator (5 pins), 7_Sensitivity (5 pins)
out: 1_Calculation and search of the working point (Q11.1 R7.1), 2_Thermal stability (Q1.1 R9.1), 3_Reinforcing properties  Frequency characteristics (Q3.1 R4.1), 4_A real transistor (Q6.3 R30.1), 5_Changing the gain (Q4.3 R21.1), 6_Oscillator (Q16.3 R33.1), 7_Sensitivity (Q2.3 R13.1)
Vcc: 1_Calculation and search of the working point (R1.2 R7.2 V1.1), 2_Thermal stability (R8.2 R9.2 V3.1), 3_Reinforcing properties  Frequency characteristics (R3.2 R4.2 V2.1), 4_A real transistor (R29.2 R30.2 V14.1), 5_Changing the gain (R20.2 R21.2 V10.1), 6_Oscillator (R33.2 R39.2 V24.1), 7_Sensitivity (R12.2 R13.2 V4.1)